# Altium schematic sheet RTCC.SchDoc
size A; SheetNumber: 10
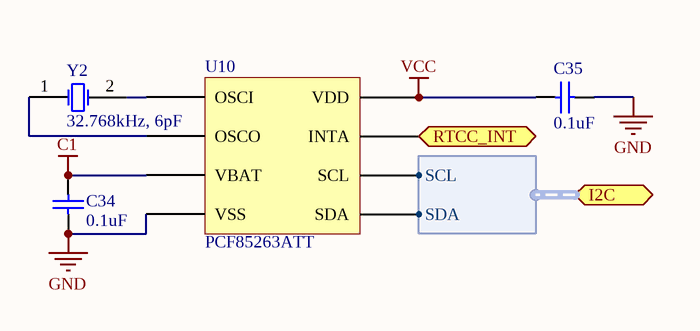
[diagram p0: RTCC.SchDoc]

## Parts
C34  value 0.1uF  [C0402[1005X55]]  (hidden comment: 0.1uF 6.3V 0402)
C35  value 0.1uF  [C0402[1005X55]]  (hidden comment: 0.1uF 6.3V 0402)
U10  PCF85263ATT  [TSSOP-8]
Y2  32.768kHz, 6pF  [ST3215SB]

## Ports
I2C (harness I2C), RTCC_INT (out)

## Harnesses
I2C: SCL, SDA

## Nets
C1: C34.2 U10.3(VBAT)
GND: C34.1 C35.2 U10.4(VSS)
VCC: C35.1 U10.8(VDD)
RTCC_INT: U10.7(INTA) ; port RTCC_INT
NetU10_1: U10.1(OSCI) Y2.2(X2)
NetU10_2: U10.2(OSCO) Y2.1(X1)
NetU10_5: U10.5(SDA) ; port I2C.SDA
NetU10_6: U10.6(SCL) ; port I2C.SCL

## Library data of the parts
C34 C35 = CAP_0.1uF_6.3V_0402_10%: 0.1uF 6.3V 10% 0402 (1005 Metric); PartNumber: GRM155R70J104KA01D; Manufacturer: Murata; Mounting Technology: Surface Mount; PackageReference: 0402; PackageDescription: 0402 (1005 Metric); Voltage: 6.3V; Tolerance: 10%
U10 = PCF85263ATT: Real Time Clock Real-Time Clock calendar; PartNumber: PCF85263ATT/AJ; Manufacturer: Texas Instruments; Mounting Technology: Surface Mount; PackageReference: TSSOP-8
Y2 = ST3215SB32768B0HPWB3: 32.768kHz ±20ppm Crystal 6pF 60 kOhm -40°C ~ 85°C Surface Mount 2-SMD, No Lead (DFN, LCC); Manufacturer: AVX/Kyocera; PackageDescription: 2-SMD, No Lead (DFN, LCC); PackageReference: ST3215SB; Mounting Technology: Surface Mount; PartNumber: ST3215SB32768B0HPWB3